# Altium schematic sheet Interface - USB-C.SchDoc: [12] Interface - USB-C
size A4; ApprovedBy: Nagy Richard; CheckedBy: Nagy Richard; Author: Nagy Richard; CompanyName: EmbedCore; DrawnBy: Nagy Richard; Engineer: Nagy Richard; Organization: EmbedCore; DocumentNumber: 12; Revision: 1.0; SheetNumber: 12; SheetTotal: 15
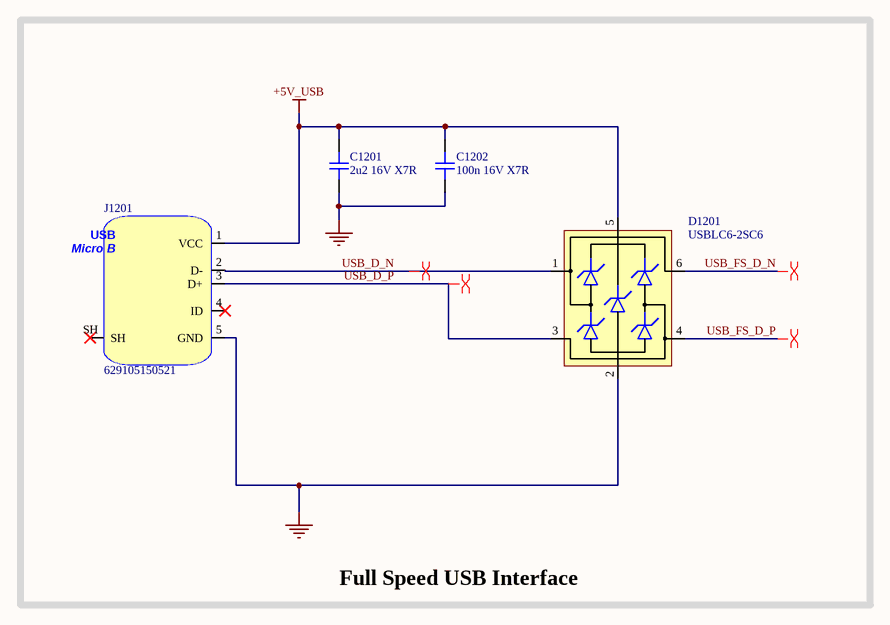
[diagram p0: Interface - USB-C.SchDoc]

## Parts
C1201  2u2 16V X7R  [CAP_0603]
C1202  100n 16V X7R  [CAP_0402]
D1201  USBLC6-2SC6  [SOT-23-6]
J1201  629105150521  [629105150521]

## Blocks framed on the sheet
Full Speed USB Interface: C1201 C1202 D1201 J1201

## Nets
+5V_USB: C1201.2 C1202.2 D1201.5(VBUS) J1201.1(VCC)
GND: C1201.1 C1202.1 D1201.2(GND) J1201.5(GND)
USB_D_N: D1201.1(IO1) J1201.2(D-)
USB_D_P: D1201.3(IO2) J1201.3(D+)
USB_FS_D_N: D1201.6(IO1)
USB_FS_D_P: D1201.4(IO2)

Not connected (* = marked no-connect by the designer): J1201 4(ID)* SH*

## Layout directives
differential pair: USB_D_N, USB_D_P, USB_FS_D_N, USB_FS_D_P

## Notes on the sheet
- Title:
- Drawn By:
- Page Contents:
- Checked By:
- Size:
- Date:
- File:
- License:
- Email:
- A4
- Number:
- Time:
- Revision:
- Sheet
- Website:
- of
- (in symbol 629105150521) USB; Micro B

## Library data of the parts
C1201 = CAP_0603: Capacitor SMD 0603; Manufacturer: YAGEO; Manufacturer Part Number: CC0603KRX7R7BB225; Distributor Link: www.lcsc.com; LCSC: C914769; Rating: *; Dielectric: *
C1202 = CAP_0402: Capacitor SMD 0402; Manufacturer: YAGEO; Manufacturer Part Number: CC0402JRX7R7BB104; Distributor Link: www.lcsc.com; LCSC: C541464; Rating: *; Dielectric: *
D1201 = USBLC6-2SC6: Low-Capacitance ESD Protection USB; Manufacturer: STMicroelectronics; Manufacturer Part Number: USBLC6-2SC6; Distributor Link: https://www.mouser.de/ProductDetail/STMicroelectronics/USBLC6-2SC6?qs=po45yt2pPpu%2FhNIlwQdTlg%3D%3D
J1201 = 629105150521: USB Connector Type Micro B 2.0 SMD; Manufacturer: Wurth; Manufacturer Part Number: 629105150521; Distributor Link: https://www.mouser.de/ProductDetail/Wurth-Elektronik/629105150521?qs=a9WhcLg8qCzXiH7kZP8GRQ%3D%3D